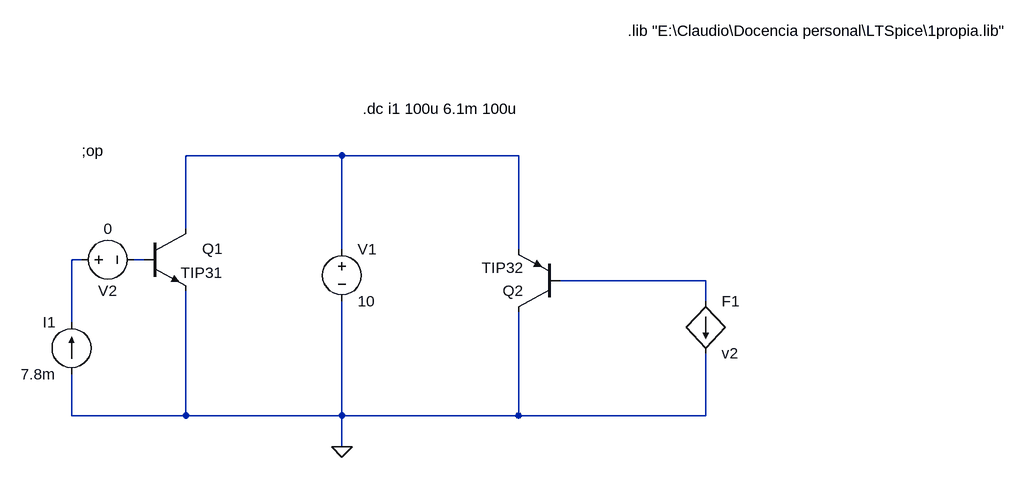
[diagram p0: schematic TIP31TIP32.asc]
TIP31TIP32.asc, the LTspice schematic file:
Version 4
SHEET 1 1392 984
WIRE -432 208 -672 208
WIRE -160 208 -432 208
WIRE -672 320 -672 208
WIRE -432 352 -432 208
WIRE -160 352 -160 208
WIRE -832 368 -848 368
WIRE -736 368 -752 368
WIRE 128 400 -96 400
WIRE 128 432 128 400
WIRE -848 464 -848 368
WIRE -848 608 -848 544
WIRE -672 608 -672 416
WIRE -672 608 -848 608
WIRE -432 608 -432 432
WIRE -432 608 -672 608
WIRE -160 608 -160 448
WIRE -160 608 -432 608
WIRE 128 608 128 512
WIRE 128 608 -160 608
WIRE -432 656 -432 608
FLAG -432 656 0
SYMBOL npn -736 320 R0
WINDOW 0 89 31 Left 2
SYMATTR InstName Q1
SYMATTR Value TIP31
SYMBOL pnp -96 448 R180
SYMATTR InstName Q2
SYMATTR Value TIP32
SYMBOL voltage -432 336 R0
WINDOW 123 0 0 Left 0
WINDOW 39 0 0 Left 0
SYMATTR InstName V1
SYMATTR Value 10
SYMBOL current -848 544 R180
WINDOW 0 24 80 Left 2
WINDOW 3 24 0 Left 2
WINDOW 123 0 0 Left 0
WINDOW 39 0 0 Left 0
SYMATTR InstName I1
SYMATTR Value 7.8m
SYMBOL f 128 432 R0
SYMATTR InstName F1
SYMATTR Value v2
SYMATTR Value2 1
SYMBOL voltage -848 368 R270
WINDOW 0 -32 56 VBottom 2
WINDOW 3 32 56 VTop 2
WINDOW 123 0 0 Left 0
WINDOW 39 0 0 Left 0
SYMATTR InstName V2
SYMATTR Value 0
TEXT 8 16 Left 2 !.lib "E:\\Claudio\\Docencia personal\\LTSpice\\1propia.lib"
TEXT -832 200 Left 2 !;op
TEXT -400 136 Left 2 !.dc i1 100u 6.1m 100u

The netlist it stands for:
* TIP31TIP32.asc
Q1 N001 N003 0 0 TIP31
Q2 0 N004 N001 0 TIP32
V1 N001 0 10
I1 0 N002 7.8m
F1 N004 0 v2 1
V2 N002 N003 0
.model NPN NPN
.model PNP PNP
.lib standard.bjt
.lib "E:\Claudio\Docencia personal\LTSpice\1propia.lib"
;op
.dc i1 100u 6.1m 100u
.backanno
.end